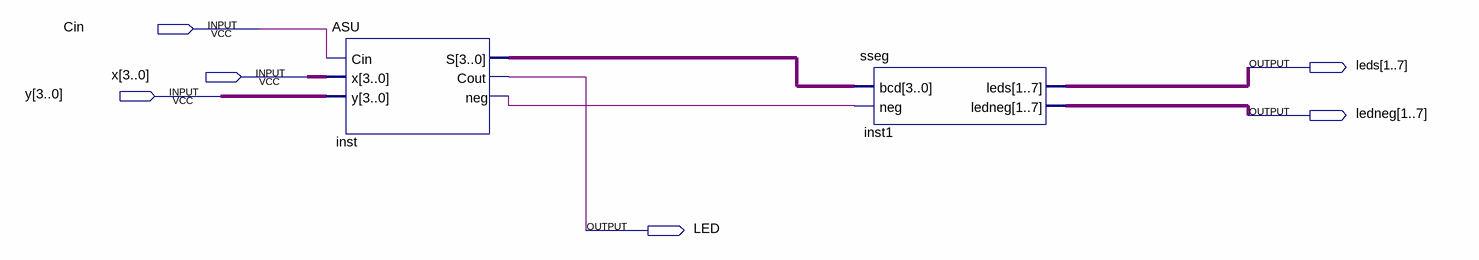
[diagram p0: schematic sheet]
// Quartus schematic CombinedASU2.bdf as structural Verilog: 2 symbols, 6 pins
module CombinedASU2 (
  input  Cin,
  input  [3:0] x,
  input  [3:0] y,
  output [1:7] leds,
  output [1:7] ledneg,
  output LED
);

  wire inst_neg;
  wire [3:0] inst_s;

  ASU inst (.Cin(Cin), .x(x), .y(y), .S(inst_s), .Cout(LED), .neg(inst_neg));
  sseg inst1 (.bcd(inst_s), .neg(inst_neg), .leds(leds), .ledneg(ledneg));
endmodule
